# EAGLE design pov-globe2 (EAGLE 6.6.0)
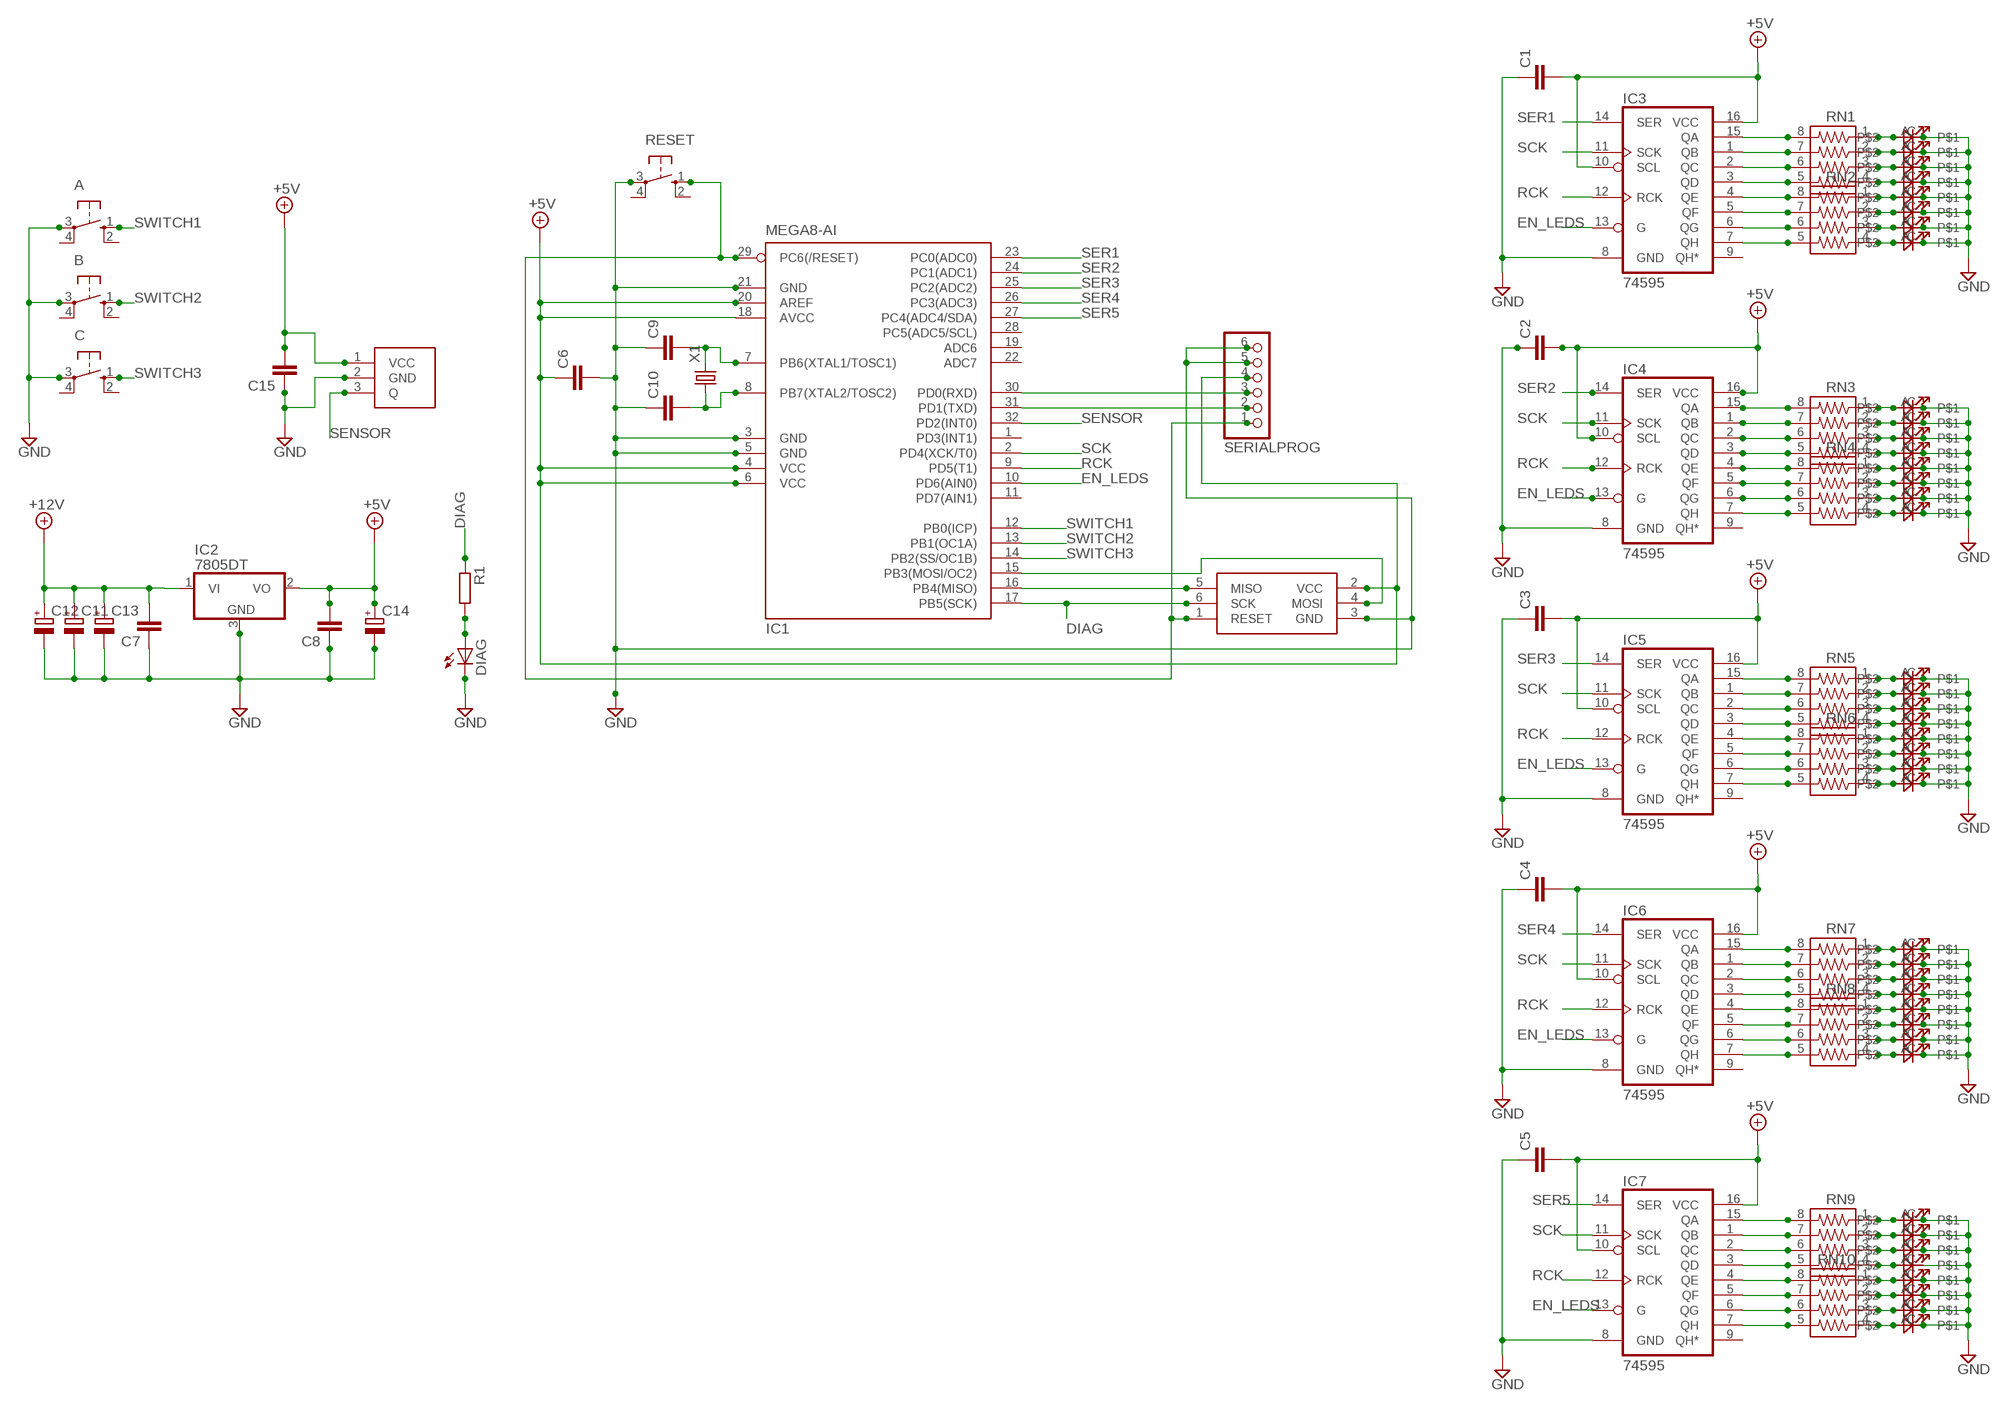
[diagram p0: schematic, sheet 1]

## Parts
0  3MMLEDSIDELED1_8MMSIDE  [LED1_8MMSIDE]
1  3MMLEDSIDELED1_8MMSIDE  [LED1_8MMSIDE]
2  3MMLEDSIDELED1_8MMSIDE  [LED1_8MMSIDE]
3  3MMLEDSIDELED1_8MMSIDE  [LED1_8MMSIDE]
4  3MMLEDSIDELED1_8MMSIDE  [LED1_8MMSIDE]
5  3MMLEDSIDELED1_8MMSIDE  [LED1_8MMSIDE]
6  3MMLEDSIDELED1_8MMSIDE  [LED1_8MMSIDE]
7  3MMLEDSIDELED1_8MMSIDE  [LED1_8MMSIDE]
8  3MMLEDSIDELED1_8MMSIDE  [LED1_8MMSIDE]
9  3MMLEDSIDELED1_8MMSIDE  [LED1_8MMSIDE]
10  3MMLEDSIDELED1_8MMSIDE  [LED1_8MMSIDE]
11  3MMLEDSIDELED1_8MMSIDE  [LED1_8MMSIDE]
12  3MMLEDSIDELED1_8MMSIDE  [LED1_8MMSIDE]
13  3MMLEDSIDELED1_8MMSIDE  [LED1_8MMSIDE]
14  3MMLEDSIDELED1_8MMSIDE  [LED1_8MMSIDE]
15  3MMLEDSIDELED1_8MMSIDE  [LED1_8MMSIDE]
16  3MMLEDSIDELED1_8MMSIDE  [LED1_8MMSIDE]
17  3MMLEDSIDELED1_8MMSIDE  [LED1_8MMSIDE]
18  3MMLEDSIDELED1_8MMSIDE  [LED1_8MMSIDE]
19  3MMLEDSIDELED1_8MMSIDE  [LED1_8MMSIDE]
20  3MMLEDSIDELED1_8MMSIDE  [LED1_8MMSIDE]
21  3MMLEDSIDELED1_8MMSIDE  [LED1_8MMSIDE]
22  3MMLEDSIDELED1_8MMSIDE  [LED1_8MMSIDE]
23  3MMLEDSIDELED1_8MMSIDE  [LED1_8MMSIDE]
24  3MMLEDSIDELED1_8MMSIDE  [LED1_8MMSIDE]
25  3MMLEDSIDELED1_8MMSIDE  [LED1_8MMSIDE]
26  3MMLEDSIDELED1_8MMSIDE  [LED1_8MMSIDE]
27  3MMLEDSIDELED1_8MMSIDE  [LED1_8MMSIDE]
28  3MMLEDSIDELED1_8MMSIDE  [LED1_8MMSIDE]
29  3MMLEDSIDELED1_8MMSIDE  [LED1_8MMSIDE]
30  3MMLEDSIDELED1_8MMSIDE  [LED1_8MMSIDE]
31  3MMLEDSIDELED1_8MMSIDE  [LED1_8MMSIDE]
32  3MMLEDSIDELED1_8MMSIDE  [LED1_8MMSIDE]
33  3MMLEDSIDELED1_8MMSIDE  [LED1_8MMSIDE]
34  3MMLEDSIDELED1_8MMSIDE  [LED1_8MMSIDE]
35  3MMLEDSIDELED1_8MMSIDE  [LED1_8MMSIDE]
36  3MMLEDSIDELED1_8MMSIDE  [LED1_8MMSIDE]
37  3MMLEDSIDELED1_8MMSIDE  [LED1_8MMSIDE]
38  3MMLEDSIDELED1_8MMSIDE  [LED1_8MMSIDE]
39  3MMLEDSIDELED1_8MMSIDE  [LED1_8MMSIDE]
A  10-XX  [B3F-10XX]
B  10-XX  [B3F-10XX]
C  10-XX  [B3F-10XX]
C1  C-EUC0805  [C0805]
C2  C-EUC0805  [C0805]
C3  C-EUC0805  [C0805]
C4  C-EUC0805  [C0805]
C5  C-EUC0805  [C0805]
C6  C-EUC0805  [C0805]
C7  C-EUC0805  [C0805]
C8  C-EUC0805  [C0805]
C9  C-EUC0805  [C0805]
C10  C-EUC0805  [C0805]
C11  CPOL-EUE2-5  [E2-5]
C12  CPOL-EUE2-5  [E2-5]
C13  CPOL-EUE2-5  [E2-5]
C14  CPOL-EUE2-5  [E2-5]
C15  C-EUC0805  [C0805]
DIAG  LEDCHIP-LED0805  [CHIP-LED0805]
IC1  MEGA8-AI  [TQFP32-08]
IC2  7805DT  [TO252]
IC3  74595  [TSSOP16]
IC4  74595  [TSSOP16]
IC5  74595  [TSSOP16]
IC6  74595  [TSSOP16]
IC7  74595  [TSSOP16]
ICSP  TAG_CONN_AVR  [TC2030-MCP-NL]
R1  R-EU_R0805  [R0805]
RESET  10-XX  [B3F-10XX]
RN1  741-8  [741-8]
RN2  741-8  [741-8]
RN3  741-8  [741-8]
RN4  741-8  [741-8]
RN5  741-8  [741-8]
RN6  741-8  [741-8]
RN7  741-8  [741-8]
RN8  741-8  [741-8]
RN9  741-8  [741-8]
RN10  741-8  [741-8]
S1  3144HALLSWITCH  [3144HALLSWITCH]
SERIALPROG  PINHD-1X6  [1X06]
X1  CRYSTALHC49U-V  [HC49U-V]

## Nets
+5V: C1.2 C2.2 C3.2 C4.2 C5.2 C6.1 C8.2 C14.+ C15.2 IC1.4(VCC) IC1.6(VCC) IC1.18(AVCC) IC1.20(AREF) IC2.2(VO) IC3.10(SCL) IC3.16(VCC) IC4.10(SCL) IC4.16(VCC) IC5.10(SCL) IC5.16(VCC) IC6.10(SCL) IC6.16(VCC) IC7.10(SCL) IC7.16(VCC) ICSP.2(VCC) S1.1(VCC) SERIALPROG.4
+12V: C7.2 C11.+ C12.+ C13.+ IC2.1(VI)
DIAG: IC1.17(PB5(SCK)) ICSP.6(SCK) R1.1
EN_LEDS: IC1.10(PD6(AIN0)) IC3.13(G) IC4.13(G) IC5.13(G) IC6.13(G) IC7.13(G)
GND: 0.C 1.C 2.C 3.C 4.C 5.C 6.C 7.C 8.C 9.C 10.C 11.C 12.C 13.C 14.C 15.C 16.C 17.C 18.C 19.C 20.C 21.C 22.C 23.C 24.C 25.C 26.C 27.C 28.C 29.C 30.C 31.C 32.C 33.C 34.C 35.C 36.C 37.C 38.C 39.C A.3(P) B.3(P) C1.1 C2.1 C3.1 C4.1 C5.1 C6.2 C7.1 C8.1 C9.1 C10.1 C11.- C12.- C13.- C14.- C15.1 C.3(P) DIAG.C IC1.3(GND) IC1.5(GND) IC1.21(GND) IC2.3(GND) IC3.8(GND) IC4.8(GND) IC5.8(GND) IC6.8(GND) IC7.8(GND) ICSP.3(GND) RESET.3(P) S1.2(GND) SERIALPROG.5 SERIALPROG.6
N$1: 0.A RN1.1
N$2: 1.A RN1.2
N$3: 2.A RN1.3
N$4: 3.A RN1.4
N$5: IC3.15(QA) RN1.8
N$6: IC3.1(QB) RN1.7
N$7: IC3.2(QC) RN1.6
N$8: IC3.3(QD) RN1.5
N$9: 4.A RN2.1
N$10: 5.A RN2.2
N$11: 6.A RN2.3
N$12: 7.A RN2.4
N$13: IC3.4(QE) RN2.8
N$14: IC3.5(QF) RN2.7
N$15: IC3.6(QG) RN2.6
N$16: IC3.7(QH) RN2.5
N$17: IC1.31(PD1(TXD)) SERIALPROG.2
N$18: IC1.30(PD0(RXD)) SERIALPROG.3
N$19: IC1.16(PB4(MISO)) ICSP.5(MISO)
N$20: IC6.15(QA) RN7.8
N$21: IC1.15(PB3(MOSI/OC2)) ICSP.4(MOSI)
N$22: IC6.1(QB) RN7.7
N$23: 8.A RN3.1
N$24: 9.A RN3.2
N$25: 10.A RN3.3
N$26: 11.A RN3.4
N$27: IC4.15(QA) RN3.8
N$28: IC4.1(QB) RN3.7
N$29: IC4.2(QC) RN3.6
N$30: IC4.3(QD) RN3.5
N$31: 12.A RN4.1
N$32: 13.A RN4.2
N$33: 14.A RN4.3
N$34: 15.A RN4.4
N$35: IC4.4(QE) RN4.8
N$36: IC4.5(QF) RN4.7
N$37: IC4.6(QG) RN4.6
N$38: IC1.29(PC6(/RESET)) ICSP.1(RESET) RESET.1(S) SERIALPROG.1
N$39: DIAG.A R1.2
N$40: IC4.7(QH) RN4.5
N$41: 16.A RN5.1
N$42: 17.A RN5.2
N$43: 18.A RN5.3
N$44: 19.A RN5.4
N$45: IC5.15(QA) RN5.8
N$46: IC5.1(QB) RN5.7
N$47: IC5.2(QC) RN5.6
N$48: IC5.3(QD) RN5.5
N$49: 20.A RN6.1
N$50: 21.A RN6.2
N$51: 22.A RN6.3
N$52: 23.A RN6.4
N$53: IC5.4(QE) RN6.8
N$54: IC5.5(QF) RN6.7
N$55: IC5.6(QG) RN6.6
N$56: IC5.7(QH) RN6.5
N$57: IC6.2(QC) RN7.6
N$58: IC6.3(QD) RN7.5
N$59: C9.2 IC1.7(PB6(XTAL1/TOSC1)) X1.2
N$60: C10.2 IC1.8(PB7(XTAL2/TOSC2)) X1.1
N$61: IC6.4(QE) RN8.8
N$62: IC6.5(QF) RN8.7
N$63: IC6.6(QG) RN8.6
N$64: IC6.7(QH) RN8.5
N$65: 39.A RN10.4
N$66: 31.A RN8.4
N$67: 30.A RN8.3
N$68: 29.A RN8.2
N$69: 28.A RN8.1
N$70: 27.A RN7.4
N$71: 26.A RN7.3
N$72: 25.A RN7.2
N$73: 24.A RN7.1
N$74: 38.A RN10.3
N$75: 37.A RN10.2
N$76: 36.A RN10.1
N$77: 35.A RN9.4
N$78: 34.A RN9.3
N$79: 33.A RN9.2
N$80: 32.A RN9.1
N$81: IC7.15(QA) RN9.8
N$82: IC7.1(QB) RN9.7
N$83: IC7.2(QC) RN9.6
N$84: IC7.3(QD) RN9.5
N$85: IC7.4(QE) RN10.8
N$86: IC7.5(QF) RN10.7
N$87: IC7.6(QG) RN10.6
N$88: IC7.7(QH) RN10.5
RCK: IC1.9(PD5(T1)) IC3.12(RCK) IC4.12(RCK) IC5.12(RCK) IC6.12(RCK) IC7.12(RCK)
SCK: IC1.2(PD4(XCK/T0)) IC3.11(SCK) IC4.11(SCK) IC5.11(SCK) IC6.11(SCK) IC7.11(SCK)
SENSOR: IC1.32(PD2(INT0)) S1.3(Q)
SER1: IC1.23(PC0(ADC0)) IC3.14(SER)
SER2: IC1.24(PC1(ADC1)) IC4.14(SER)
SER3: IC1.25(PC2(ADC2)) IC5.14(SER)
SER4: IC1.26(PC3(ADC3)) IC6.14(SER)
SER5: IC1.27(PC4(ADC4/SDA)) IC7.14(SER)
SWITCH1: A.1(S) IC1.12(PB0(ICP))
SWITCH2: B.1(S) IC1.13(PB1(OC1A))
SWITCH3: C.1(S) IC1.14(PB2(SS/OC1B))
Unconnected: A.2(S1) A.4(P1) B.2(S1) B.4(P1) C.2(S1) C.4(P1) IC1.1(PD3(INT1)) IC1.11(PD7(AIN1)) IC1.19(ADC6) IC1.22(ADC7) IC1.28(PC5(ADC5/SCL)) IC3.9(QH*) IC4.9(QH*) IC5.9(QH*) IC6.9(QH*) IC7.9(QH*) RESET.2(S1) RESET.4(P1)

## Library data of the parts
0 1-39 = jason_eagle6:3MMLEDSIDE
A B C RESET = switch-omron:10-XX: OMRON SWITCH
C1-C10 C15 = rcl:C-EU: CAPACITOR, European symbol
C11-C14 = rcl:CPOL-EU: POLARIZED CAPACITOR, European symbol
DIAG = led:LED: LED OSRAM: - CHIPLED LG R971, LG N971, LY N971, LG Q971, LY Q971, LO R971, LY R971 LH N974, LH R974 LS Q976, LO Q976, LY Q976 LO Q996 - Hyper CHIPLED LW Q18S LB Q993, LB Q99A, LB R99A - SideLED LS A670, LO A670, LY A670, LG A670, LP A670 LB A673, LV A673, LT A673, LW A673 LH A674 LY A675 LS A676, LA A676, LO A676, LY A676, LW A676 LS A679, LY A679, LG A679 - Hyper Micro SIDELED® LS Y876, LA Y876, LO Y876, LY Y876 LT Y87S - SmartLED LW L88C, LW L88S LB L89C, LB L89S, LG L890 LS L89K, LO L89K, LY L89K LS L896, LA L896, LO L896, LY L896 - TOPLED LS T670, LO T670, LY T670, LG T670, LP T670 LSG T670, LSP T670, LSY T670, LOP T670, LYG T670 LG T671, LOG T671, LSG T671 LB T673, LV T673, LT T673, LW T673 LH T674 LS T676, LA T676, LO T676, LY T676, LB T676, LH T676, LSB T676, LW T676 LB T67C, LV T67C, LT T67C, LS T67K, LO T67K, LY T67K, LW E67C LS E67B, LA E67B, LO E67B, LY E67B, LB E67C, LV E67C, LT E67C LW T67C LS T679, LY T679, LG T679 LS T770, LO T770, LY T770, LG T770, LP T770 LB T773, LV T773, LT T773, LW T773 LH T774 LS E675, LA E675, LY E675, LS T675 LS T776, LA T776, LO T776, LY T776, LB T776 LHGB T686 LT T68C, LB T68C - Hyper Mini TOPLED® LB M676 - Mini TOPLED Santana® LG M470 LS M47K, LO M47K, LY M47K Source: http://www.osram.convergy.de LUXEON: - LUMILED® LXK2-PW12-R00, LXK2-PW12-S00, LXK2-PW14-U00, LXK2-PW14-V00 LXK2-PM12-R00, LXK2-PM12-S00, LXK2-PM14-U00 LXK2-PE12-Q00, LXK2-PE12-R00, LXK2-PE12-S00, LXK2-PE14-T00, LXK2-PE14-U00 LXK2-PB12-K00, LXK2-PB12-L00, LXK2-PB12-M00, LXK2-PB14-N00, LXK2-PB14-P00, LXK2-PB14-Q00 LXK2-PR12-L00, LXK2-PR12-M00, LXK2-PR14-Q00, LXK2-PR14-R00 LXK2-PD12-Q00, LXK2-PD12-R00, LXK2-PD12-S00 LXK2-PH12-R00, LXK2-PH12-S00 LXK2-PL12-P00, LXK2-PL12-Q00, LXK2-PL12-R00 Source: www.luxeon.com KINGBRIGHT: KA-3528ASYC Source: www.kingbright.com
IC1 = atmel:MEGA8: MICROCONTROLLER 8 Kbytes FLASH, 1 kbytes SRAM, 512 bytes EEPROM, USART, 6-channel 10 bit ADC, 2-channel 8 bit ADC Pin compatible with Atmega48, ATMega88, ATMega168 Source: avr.lbr
IC2 = linear:78*: Positive VOLTAGE REGULATOR Source: http://cache.national.com/ds/LM/LM78L05.pdf http://www.fairchildsemi.com/ds/LM/LM7805.pdf
IC3-IC7 = SparkFun:74*595: 8-bit SHIFT REGISTER, output latch
ICSP = jasons_stuff:TAG_CONN_AVR
R1 = resistor:R-EU_: RESISTOR, European symbol
RN1-RN10 = resistor-array:741-8: CTS 741 Series 8 Terminations, 4 Resistors
S1 = jason_eagle6:3144HALLSWITCH
SERIALPROG = pinhead:PINHD-1X6: PIN HEADER
X1 = crystal:CRYSTAL: CRYSTAL

## Board
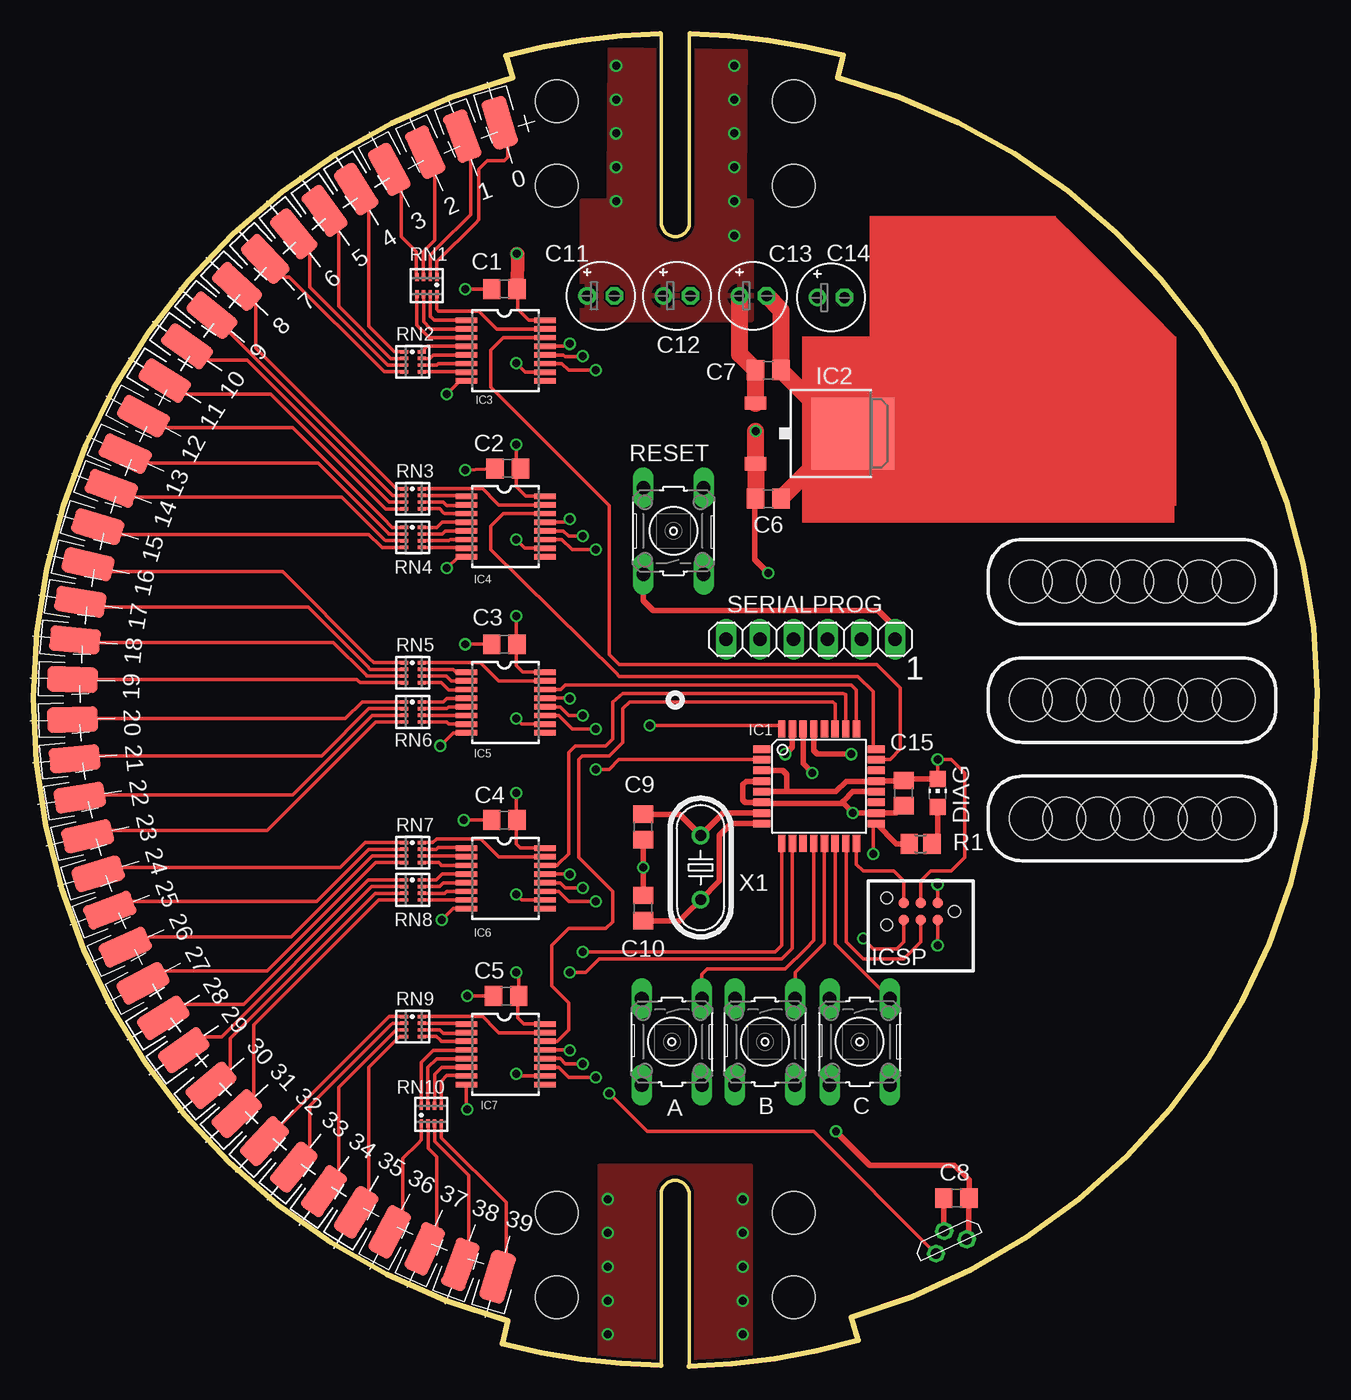
[diagram p1: board, top side]
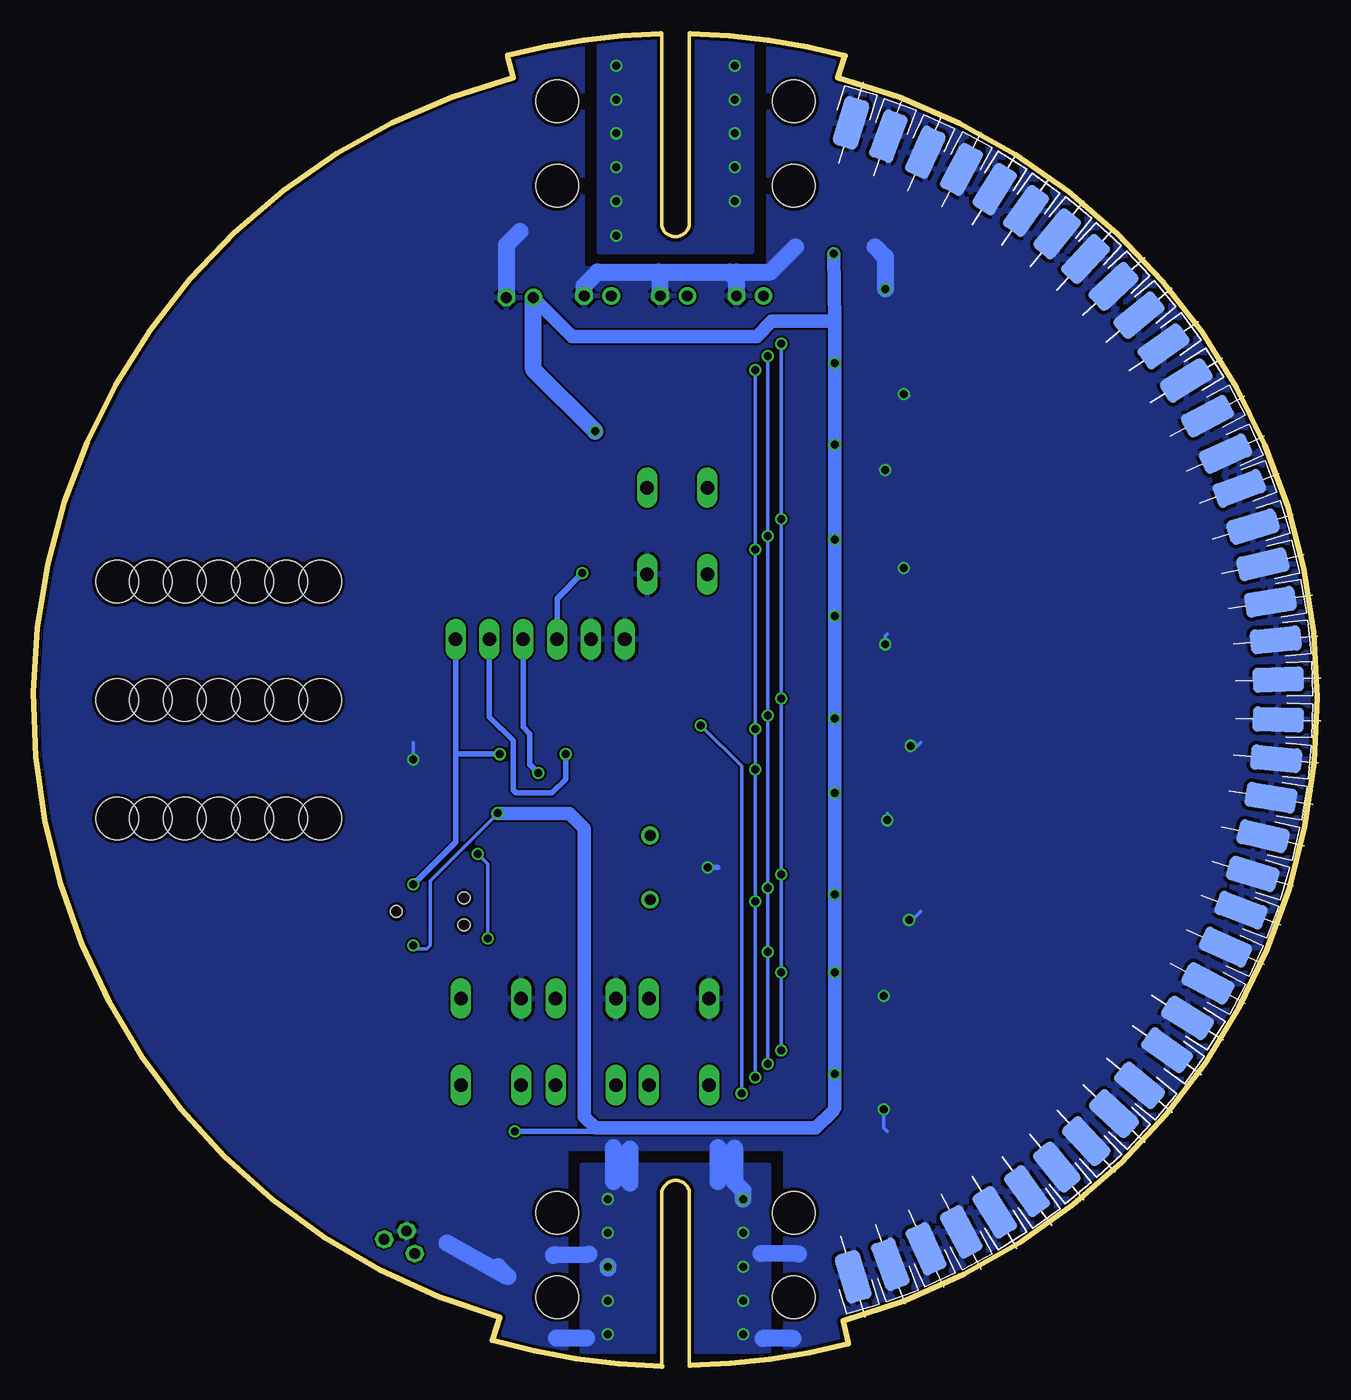
[diagram p2: board, bottom side, seen from below]

Size 96.38 x 100.08 mm. Coordinates in mm from the lower left corner, seen from the top.
Outline: 35.48,98.4 35.99,96.75 arc150 35.61,3.4 35.23,1.75
Outline: 61.9,2.01 61.39,3.66 arc149 60.37,96.75 60.75,98.27
Outline: 47.14,100.08 47.14,85.67
Outline: 49.22,100.03 49.22,85.65
Outline: 49.22,13.08 49.22,0 arc15 61.92,1.93
Outline: 47.14,0 47.14,13.11
Outline: 49.2,13.13 arc154 47.14,13.13
Outline: 47.16,85.62 arc154 49.22,85.62
Outline: 35.46,98.4 arc-13 47.06,100.05
Outline: 49.3,100.05 arc-13 60.78,98.42
Outline: 35.2,1.7 arc14 47.09,0.08
Copper layers (1*16): Top 0.035mm / dielectric 1.5mm / Bottom 0.035mm
Design rules "ITEADstudio_DRC": minimum track width 6mil, minimum drill 12mil, track to track 6mil, track to pad 6mil, pad to pad 6mil, via to via 6mil, smd to smd 0mil, copper to edge 10mil, drill to drill 10mil, minimum pad ring 10mil, minimum via ring 6mil, stop-mask expansion 2mil, vias tented up to drill 100mil, thermal gap 10mil
Holes 3.2 mm at 79.93,58.9 90.09,58.9 82.47,58.9 74.85,58.9 77.39,58.9 85.01,58.9 87.55,58.9 79.93,50.01 90.09,50.01 82.47,50.01 74.85,50.01 77.39,50.01 85.01,50.01 87.55,50.01 79.93,41.12 90.09,41.12 82.47,41.12 74.85,41.12 77.39,41.12 85.01,41.12 87.55,41.12 39.29,88.62 57.07,88.62 39.29,11.53 57.07,11.53 39.29,94.97 57.07,94.97 39.29,5.18 57.07,5.18

### Footprints (pad centres in the part's own frame; a part is rotated, then mirrored left to right if it is on the bottom)
LED1_8MMSIDE = smd 3.81 x 1.905: A -3.175,0 | smd 3.81 x 1.905 bottom: C -3.175,0
B3F-10XX = drill 1.016 long: 1 -3.251,2.261; 2 3.251,2.261; 3 -3.251,-2.261; 4 3.251,-2.261
C0805 = smd 1.3 x 1.5: 1 -0.95,0; 2 0.95,0
E2-5 = drill 0.813 pad 1.27: + -1.016,0 | drill 0.813 pad 1.27 octagon: - 1.016,0
CHIP-LED0805 = smd 1.2 x 1.2: A 0,-1.05; C 0,1.05
TQFP32-08 = smd 1.27 x 0.559: 1 -4.293,2.8; 2 -4.293,2; 3 -4.293,1.2; 4 -4.293,0.4; 5 -4.293,-0.4; 6 -4.293,-1.2; 7 -4.293,-2; 8 -4.293,-2.8; 17 4.293,-2.8; 18 4.293,-2; 19 4.293,-1.2; 20 4.293,-0.4; 21 4.293,0.4; 22 4.293,1.2; 23 4.293,2; 24 4.293,2.8 | smd 0.559 x 1.27: 9 -2.8,-4.293; 10 -2,-4.293; 11 -1.2,-4.293; 12 -0.4,-4.293; 13 0.4,-4.293; 14 1.2,-4.293; 15 2,-4.293; 16 2.8,-4.293; 25 2.8,4.293; 26 2,4.293; 27 1.2,4.293; 28 0.4,4.293; 29 -0.4,4.293; 30 -1.2,4.293; 31 -2,4.293; 32 -2.8,4.293
TO252 = smd 1 x 1.6: 1 -2.28,-4.8; 2 2.28,-4.8 | smd 5.4 x 6.2: 3 0,2.5
TSSOP16 = smd 0.4 x 1.6: 1 -2.225,-2.85; 2 -1.575,-2.85; 3 -0.925,-2.85; 4 -0.275,-2.85; 5 0.375,-2.85; 6 1.025,-2.85; 7 1.675,-2.85; 8 2.325,-2.85; 9 2.325,3.05; 10 1.675,3.05; 11 1.025,3.05; 12 0.375,3.05; 13 -0.275,3.05; 14 -0.925,3.05; 15 -1.575,3.05; 16 -2.225,3.05
TC2030-MCP-NL = smd 0.787 x 0.787: 1 1.27,-0.635; 2 1.27,0.635; 3 2.54,-0.635; 4 2.54,0.635; 5 3.81,-0.635; 6 3.81,0.635 | hole 0.889: 0,0; 5.08,-1.016; 5.08,1.016
R0805 = smd 1.3 x 1.5: 1 -0.85,0; 2 0.85,0
741-8 = smd 0.25 x 0.61: 1 -0.75,-0.65; 2 -0.25,-0.65; 3 0.25,-0.65; 4 0.75,-0.65; 5 0.75,0.65; 6 0.25,0.65; 7 -0.25,0.65; 8 -0.75,0.65
3144HALLSWITCH = drill 0.8 octagon: 1 -1.905,-1.27; 2 -0.635,0; 3 -1.905,1.27
1X06 = drill 1.016 long: 1 -6.35,0; 2 -3.81,0; 3 -1.27,0; 4 1.27,0; 5 3.81,0; 6 6.35,0
HC49U-V = drill 0.813: 1 -2.413,0; 2 2.413,0

### Placement (x,y rotation side)
0  34.08,96.39 106.9 top
1  31.09,95.33 110.6 top
2  28.11,94.03 114.4 top
3  25.22,92.66 118.1 top
4  22.55,91.08 121.9 top
5  20.01,89.33 125.6 top
6  17.52,87.48 129.4 top
7  15.24,85.45 133.1 top
8  12.98,83.24 136.9 top
9  10.94,80.92 140.6 top
10  8.96,78.44 144.4 top
11  7.16,75.69 148.1 top
12  5.46,72.82 151.9 top
13  4.01,69.82 155.6 top
14  2.89,67.03 159.4 top
15  1.8,63.96 163.1 top
16  1.01,60.93 166.9 top
17  0.4,57.91 170.6 top
18  -0.03,54.84 174.4 top
19  -0.23,51.66 178.1 top
20  -0.23,48.44 181.9 top
21  -0.05,45.29 185.6 top
22  0.35,42.16 189.4 top
23  0.99,39.07 193.1 top
24  1.83,36.04 196.9 top
25  2.76,33.12 200.6 top
26  4.01,30.15 204.4 top
27  5.43,27.25 208.1 top
28  7.06,24.49 211.9 top
29  8.71,21.87 215.6 top
30  10.89,19.08 219.4 top
31  12.95,16.79 223.1 top
32  15.19,14.58 226.9 top
33  17.55,12.5 230.6 top
34  19.96,10.57 234.4 top
35  22.55,8.86 238.1 top
36  25.24,7.29 241.9 top
37  28.06,5.92 245.6 top
38  30.93,4.67 249.4 top
39  33.93,3.68 253.1 top
A  47.93,24.36 270 top
B  54.91,24.36 270 top
C  62.02,24.36 270 top
C1  35.35,80.87 0 top
C2  35.61,67.41 0 top
C3  35.35,54.2 0 top
C4  35.35,41 0 top
C5  35.48,27.79 0 top
C6  55.17,65.13 0 top
C7  55.17,74.78 180 top
C8  69.29,12.62 0 top
C9  45.77,40.49 90 top
C10  45.77,34.39 270 top
C11  42.59,80.37 0 top
C12  48.31,80.37 0 top
C13  54.02,80.37 0 top
C14  59.86,80.24 0 top
C15  65.33,43.03 270 top
DIAG  67.87,43.03 0 top
IC1  58.98,43.54 0 top
IC2  59,70.03 270 top
IC3  35.35,76.3 270 top
IC4  35.35,63.09 270 top
IC5  35.35,49.89 270 top
IC6  35.35,36.68 270 top
IC7  35.35,23.47 270 top
ICSP  69.14,34.14 180 top
R1  66.6,39.22 0 top
RESET  48.05,62.71 90 top
RN1  29.54,81.13 180 top
RN2  28.5,75.41 270 top
RN3  28.5,65.13 270 top
RN4  28.5,62.23 270 top
RN5  28.5,52.07 270 top
RN6  28.5,49.12 270 top
RN7  28.5,38.56 270 top
RN8  28.5,35.76 270 top
RN9  28.5,25.5 270 top
RN10  29.87,18.9 0 top
S1  68.09,10.72 115 top
SERIALPROG  58.34,54.58 180 top
X1  50.09,37.44 90 top

### Tracks (layer width: path | path; a pad name or v marks a point on that pad's centre or on a via)
+5V  (via drill 0.6)
  Top 0.254: IC7.16 36.81,25.69 36.37,26.14 36.37,27.73 C5.2 36.43,29.38 v36.24,29.57 | 36.24,40.93 36.24,39.22 36.56,38.9 IC6.16 | 36.24,40.93 C4.2 | IC5.16 36.74,52.11 36.24,52.6 36.24,54.14 | 36.24,54.14 C3.2 | IC4.16 36.96,65.32 36.24,66.04 36.24,67.1 | 36.5,67.35 C2.2 36.24,67.1 | IC3.16 37.19,78.53 36.37,79.35 36.37,80.81 C1.2 | IC7.10 36.39,21.79 v36.24,21.95 | IC6.10 36.65,35 v36.24,35.41 | 36.24,40.93 v36.24,43.03 | IC5.10 36.67,48.21 v36.24,48.64 | 36.24,54.14 v36.24,56.34 | IC4.10 36.9,61.42 v36.24,62.08 | IC3.10 36.93,74.63 v36.24,75.31 | 36.24,67.1 v36.24,69.19 | 54.61,42.27 IC1.6 54.75,42.27 | ICSP.2 v67.87,31.6
  Top 0.406: C15.2 64.78,41.54 IC1.18 v61.52,41.54 60.82,42.23 60.82,42.46 | IC1.20 61.5,43.14 60.82,42.46 | 54.75,42.27 60.63,42.27 60.82,42.46 | IC1.6 53.44,42.34 53.26,42.52 53.26,43.66 53.51,43.92 54.66,43.92 IC1.4 | v60.25,17.63 62.79,15.09 69.14,15.09 70.24,13.99 C8.2 70.2,12.59 70.2,9.68 S1.1 | IC2.2 54.22,67.76 | C6.1 54.15,65.06 54.15,60.55 v55.17,59.54
  Top 1.016: C1.2 36.35,83.48 v36.29,83.54
  Top 1.27: IC2.2 54.22,67.73 C6.1 | 54.22,67.76 v54.22,70.21
  Bottom 0.254: 61.69,41.33 61.52,41.5 v61.52,41.54 61.69,41.36 61.69,41.33 | 61.69,41.33 66.6,36.42 66.6,31.6 66.85,31.34 67.61,31.34 v67.87,31.6
  Bottom 0.406: 55.04,18.72 53.95,17.63 | 53.95,17.63 53.9,17.63 | 53.95,17.63 v60.25,17.63 | 57.07,56.74 SERIALPROG.4 57.07,57.63 v55.17,59.54
  Bottom 1.016: v36.29,83.54 36.24,78.33 | 36.24,78.33 v36.24,75.31 v36.24,69.19 v36.24,62.08 v36.24,56.34 v36.24,48.64 v36.24,43.03 v36.24,35.41 v36.24,29.57 v36.24,21.95 36.24,19.41 36.37,19.15 37.64,17.88 54.15,17.88 55.04,18.72 55.04,40.39 56.16,41.5 61.52,41.5 | C14.+ 55.93,77.32 42.08,77.32 40.94,78.46 36.37,78.46 36.24,78.33
  Bottom 1.27: v54.22,70.21 58.85,74.84 C14.+
+12V  (via drill 0.6)
  Top 1.27: IC2.1 54.2,74.76 C7.2 53.01,75.99 C13.+
  other vias: 43.74,97.64 43.74,95.1 43.74,92.56 43.74,90.02 43.74,87.48 52.63,97.64 52.63,95.1 52.63,92.56 52.63,90.02 52.63,87.48 52.63,84.89
  pour Top: 43.23,98.91 43.1,83.54 53.39,83.41 53.51,98.78
  pour Bottom: 42.47,83.67 42.47,101.45 53.9,101.45 53.9,83.67
  pour Top: 47.55,78.59 53.9,78.59 53.9,87.48 41.2,87.48 41.2,78.59
DIAG  (via drill 0.6)
  Top 0.254: v63.04,38.46 63.04,40.51 IC1.17 | ICSP.6 65.33,31.85 64.82,31.34 63.04,31.34 v62.28,32.11
  Top 0.406: R1.1 64.79,39.22 IC1.17
  Bottom 0.254: v62.28,32.11 62.28,37.69 v63.04,38.46
EN_LEDS  (via drill 0.6)
  Top 0.254: IC5.13 39.98,50.16 v40.26,50.14 | IC6.13 40.23,36.95 v40.26,36.93 | IC7.13 40.02,23.74 v40.26,23.72 | IC4.13 40.02,63.37 v40.26,63.6 | IC3.13 40.07,76.58 v40.26,76.76 | IC1.10 56.98,31.38 56.18,30.58 42.47,30.58 41.45,29.57 v40.26,29.57
  Bottom 0.254: v40.26,76.76 40.26,64.62 | 40.26,64.62 v40.26,63.6 | v40.26,63.6 40.26,50.65 | 40.26,50.65 v40.26,50.14 | v40.26,50.14 40.26,37.95 | 40.26,37.95 v40.26,36.93 | v40.26,36.93 v40.26,29.57 | v40.26,29.57 40.26,27.79 | 40.26,27.79 40.26,25.25 | 40.26,25.25 v40.26,23.72 40.26,25.25 | v40.26,50.14 40.26,50.65 | v40.26,63.6 40.26,64.62 | v40.26,36.93 40.26,37.95 | v40.26,29.57 40.26,27.79
GND  (via drill 0.6)
  Top 0.254: C1.1 v32.43,80.87 | IC3.8 32.01,73.98 v31.04,73 | C2.1 v32.43,67.28 | IC4.8 31.89,60.77 v31.04,59.92 | C3.1 v32.43,54.2 | IC5.8 31.5,47.56 v30.53,46.58 | C4.1 v32.31,41 | IC6.8 31.5,34.35 v30.65,33.5 | C5.1 v32.56,27.79 | IC7.8 32.5,19.33 v32.56,19.28 | 63.16,44.04 IC1.21 | DIAG.C v67.87,45.57 68.88,45.57 69.9,44.55 69.9,38.2 68.88,37.19 67.36,37.19 66.6,36.42 ICSP.3 | S1.2 68.34,10.17
  Top 0.406: IC1.21 63.8,43.94 | 63.8,43.94 65.28,43.94 C15.1 65.43,44.08 DIAG.C | C10.1 v45.77,37.44 C9.1 | IC1.5 56.56,43.14 | 56.56,43.14 60.23,43.14 61.01,43.92 63.78,43.92 63.8,43.94 | IC1.3 56.25,44.74 56.56,44.42 56.56,43.14 | 68.34,10.17 C8.1
  Top 1.27: C13.- 56.12,79.29 C7.1 60.69,70.21 60.69,69.7 | C6.2 60.69,69.7 | 60.69,69.7 61.52,69.7 61.5,69.71 IC2.3
  Bottom 0.254: v31.04,73 30.78,73 30.65,72.87 | v32.43,67.28 32.81,67.41 32.56,67.16 | v31.04,59.92 31.04,59.54 | v32.43,54.2 32.43,54.84 32.31,54.97 | v30.53,46.58 30.02,46.58 29.77,46.84 | v32.31,41 32.31,41.5 | v30.65,33.5 30.4,33.5 29.77,34.14 | v32.56,27.79 32.31,27.79 | v32.56,19.28 32.56,17.88 32.31,17.63 | v67.87,45.57 67.87,46.84
  Bottom 0.406: v45.77,37.44 45.01,37.44 | 51.58,13.77 52.83,13.77 52.83,13.87
  Bottom 1.27: 59.86,85.19 60.88,84.18 C14.- | C13.- 55.04,81.13 54.02,82.14 49.45,82.14 | 49.45,82.14 44.12,82.14 43.61,81.64 | 43.61,81.64 C11.- | C12.- 49.32,82.02 49.45,82.14 | 43.61,81.64 43.61,82.14 41.07,82.14 39.16,84.05 | 33.19,84.05 32.43,83.29 v32.43,80.87 | 65.33,9.26 60.77,6.72 61.52,7.47 | v53.26,7.47 53.26,7.36 | 43.74,16.36 43.74,13.82 43.1,13.18 v43.1,12.55 | 51.58,13.77 51.58,16.31 | 57.32,8.31 57.32,8.33 | 45.01,16.41 45.01,13.87 | 52.83,13.87 52.83,16.41 | 38.96,8.43 41.75,8.46 | 39.37,2.08 41.63,2.08 | 54.86,2.11 57.12,2.11 | 57.22,8.38 54.66,8.41
  other vias: 43.1,2.39 43.1,4.93 43.1,7.47 43.1,10.01 53.26,2.39 53.26,4.93 53.26,10.01 53.26,12.55
  pour Top: 42.47,15.09 53.9,15.09 53.9,-1.42 42.47,-1.42
  pour Bottom: 41.2,100.18 41.2,82.4 55.17,82.4 55.17,100.18 100.89,100.18 100.89,-1.42 56.44,-1.42 56.44,16.36 39.93,16.36 39.93,-1.42 -7.06,-1.42 -7.06,100.18
  pour Bottom: 41.2,15.09 55.17,15.09 55.17,1.12 41.2,1.12
N$1
  Top 0.254: 0.A 35.01,92.27 35.61,91.67 35.61,90.78 35.35,90.53 34.08,90.53 33.45,89.89 33.45,86.46 33.45,86.08 33.19,85.83 30.29,82.92 RN1.1
N$2
  Top 0.254: 1.A 32.2,91.26 32.81,90.65 32.81,86.46 30.4,84.05 29.79,83.43 RN1.2
N$3
  Top 0.254: 2.A 29.43,90.23 30.15,89.51 30.15,84.56 29.26,83.67 29.26,81.81 RN1.3
N$4
  Top 0.254: 3.A 26.71,89.13 27.61,88.24 27.61,84.81 28.75,83.67 28.75,81.81 RN1.4
N$5
  Top 0.254: IC3.15 34.79,77.88 33.45,79.22 30.4,79.22 30.27,79.35 30.29,79.36 RN1.8
N$6
  Top 0.254: IC3.1 30.08,78.53 29.89,78.71 29.79,78.82 RN1.7
N$7
  Top 0.254: RN1.6 29.29,78.43 29.77,77.95 29.84,77.88 IC3.2
N$8
  Top 0.254: IC3.3 29.73,77.23 29,77.95 28.79,78.17 RN1.5
N$9
  Top 0.254: 4.A 24.23,87.81 25.19,86.84 25.19,78.08 27.1,76.17 27.83,76.17 RN2.1
N$10
  Top 0.254: 5.A 21.86,86.24 22.91,85.19 22.91,79.6 26.84,75.67 RN2.2
N$11
  Top 0.254: 6.A 19.54,84.75 20.75,83.54 20.75,81 26.59,75.16 RN2.3
N$12
  Top 0.254: 7.A 17.41,82.95 18.59,81.76 19.22,81.76 26.21,74.78 26.32,74.66 RN2.4
N$13
  Top 0.254: IC3.4 29.56,76.58 RN2.8
N$14
  Top 0.254: IC3.5 30.03,75.93 29.77,75.67 RN2.7
N$15
  Top 0.254: RN2.6 30.28,75.16 30.4,75.29 32.49,75.29 IC3.6
N$16
  Top 0.254: RN2.5 32.47,74.66 IC3.7
N$17  (via drill 0.6)
  Top 0.406: IC1.31 56.98,46.49 v56.44,45.95
  Bottom 0.406: SERIALPROG.2 62.15,48.74 60.37,46.96 60.37,43.28 60.12,43.03 57.45,43.03 56.44,44.04 v56.44,45.95
N$18  (via drill 0.6)
  Top 0.406: IC1.30 57.78,45.75 57.78,45.62 57.78,45.24 v58.47,44.55
  Bottom 0.406: SERIALPROG.3 59.61,53.57 59.61,47.98 59.1,47.47 59.1,45.19 v58.47,44.55
N$19
  Top 0.254: IC1.16 61.78,37.69 62.28,37.19 64.56,37.19 65.33,36.42 65.33,35.15 ICSP.5
N$20
  Top 0.254: RN7.8 29.98,39.31 30.27,39.6 33.58,39.6 34.85,38.33 34.92,38.25 IC6.15
N$21
  Top 0.254: IC1.15 61.01,39.21 61.01,32.11 61.01,31.85 61.26,31.6 62.28,30.58 65.33,30.58 65.58,30.84 66.09,31.34 66.6,31.85 ICSP.4
N$22
  Top 0.254: RN7.7 30.24,38.81 30.4,38.96 32.44,38.96 IC6.1
N$23
  Top 0.254: 8.A 15.35,81.07 16.68,79.73 16.68,76.43 27.23,65.89 27.83,65.89 RN3.1
N$24
  Top 0.254: 9.A 13.57,78.91 14.78,77.7 14.78,77.57 26.97,65.38 RN3.2
N$25
  Top 0.254: 10.A 11.95,76.59 13,75.54 16.05,75.54 26.72,64.87 RN3.3
N$26
  Top 0.254: 11.A 10.34,74.01 11.35,73 17.83,73 26.46,64.36 27.83,64.36 RN3.4
N$27
  Top 0.254: RN3.8 33.71,65.88 34.72,64.87 34.92,64.67 IC4.15
N$28
  Top 0.254: RN3.7 32.45,65.38 IC4.1
N$29
  Top 0.254: RN3.6 30.78,64.88 31.04,64.62 32.45,64.62 IC4.2
N$30
  Top 0.254: RN3.5 30.52,64.38 30.78,64.11 30.87,64.02 IC4.3
N$31
  Top 0.254: 12.A 8.96,71.33 9.83,70.46 19.48,70.46 26.21,63.73 26.96,62.98 RN4.1
N$32
  Top 0.254: 13.A 7.84,68.51 8.56,67.79 21.38,67.79 26.59,62.59 26.7,62.48 RN4.2
N$33
  Top 0.254: 14.A 6.88,65.91 7.54,65.25 23.16,65.25 26.34,62.08 26.43,61.98 RN4.3
N$34
  Top 0.254: 15.A 5.95,63.03 6.52,62.46 25.19,62.46 26.08,61.57 26.17,61.48 RN4.4
N$35
  Top 0.254: IC4.4 30.68,63.37 30.27,62.97 29.16,62.97 RN4.8
N$36
  Top 0.254: RN4.7 30.68,62.48 30.91,62.71 IC4.5
N$37
  Top 0.254: RN4.6 31.19,61.98 31.29,62.08 32.49,62.08 IC4.6
N$38  (via drill 0.6)
  Top 0.254: v67.87,36.17 ICSP.1
  Top 0.406: IC1.29 58.58,46.22 58.85,45.95 v61.39,45.95 | RESET.1 45.79,57.48 46.53,56.74 63.42,56.74 64.69,55.47 SERIALPROG.1
  Bottom 0.406: SERIALPROG.1 64.69,47.09 64.69,46.08 | 64.69,46.08 64.69,39.34 v67.87,36.17 | v61.39,45.95 64.56,45.95 64.69,46.08
N$39
  Top 0.406: DIAG.A 67.87,39.64 R1.2
N$40
  Top 0.254: RN4.5 32.44,61.48 IC4.7
N$41
  Top 0.254: 16.A 5.34,60.21 5.89,59.66 18.72,59.66 25.19,53.19 25.56,52.82 RN5.1
N$42
  Top 0.254: 17.A 4.99,57.39 5.38,57 20.62,57 25.07,52.55 25.3,52.32 RN5.2
N$43
  Top 0.254: 18.A 4.8,54.53 5,54.33 22.53,54.33 24.94,51.92 25.04,51.82 RN5.3
N$44
  Top 0.254: 19.A 23.39,51.56 24.28,51.56 | RN5.4 24.98,51.32 24.52,51.32 24.28,51.56 | 24.28,51.56 24.43,51.41
N$45
  Top 0.254: RN5.8 33.56,52.82 34.34,52.04 34.92,51.46 IC5.15
N$46
  Top 0.254: RN5.7 31.52,52.32 31.8,52.04 32.44,52.04 IC5.1
N$47
  Top 0.254: RN5.6 31.01,51.82 31.29,51.54 31.37,51.46 IC5.2
N$48
  Top 0.254: RN5.5 30.62,51.32 31.16,50.77 32.47,50.77 IC5.3
N$49
  Top 0.254: 20.A 4.67,48.54 4.75,48.62 23.42,48.62 24.69,49.89 27.83,49.89 RN6.1
N$50
  Top 0.254: 21.A 4.78,45.6 5,45.82 21.64,45.82 25.19,49.38 RN6.2
N$51
  Top 0.254: 22.A 5.04,42.68 5.25,42.9 19.48,42.9 25.45,48.87 RN6.3
N$52
  Top 0.254: 23.A 5.44,39.78 5.89,40.23 17.57,40.23 25.45,48.11 25.71,48.37 RN6.4
N$53
  Top 0.254: RN6.8 30.77,49.87 31.04,50.14 32.48,50.14 IC5.4
N$54
  Top 0.254: RN6.7 31.03,49.37 31.16,49.5 IC5.5
N$55
  Top 0.254: RN6.6 32.49,48.87 IC5.6
N$56
  Top 0.254: IC5.7 31.19,48.21 31.04,48.36 29.16,48.36 RN6.5
N$57
  Top 0.254: RN7.6 32.45,38.31 IC6.2
N$58
  Top 0.254: RN7.5 30.41,37.81 30.53,37.69 30.62,37.6 IC6.3
N$59
  Top 0.406: IC1.7 51.77,41.54 X1.2 49.52,40.42 48.5,41.44 C9.2
N$60
  Top 0.406: IC1.8 52.37,40.74 51.48,39.85 51.48,36.42 X1.1 49.01,33.95 48.5,33.44 C10.2
N$61
  Top 0.254: RN8.8 30.24,36.51 30.65,36.93 30.68,36.95 IC6.4
N$62
  Top 0.254: RN8.7 30.5,36.01 30.78,36.3 IC6.5
N$63
  Top 0.254: RN8.6 30.89,35.51 31.04,35.66 32.49,35.66 IC6.6
N$64
  Top 0.254: RN8.5 32.49,35.01 IC6.7
N$65
  Top 0.254: 39.A 34.85,7.86 35.48,8.48 35.48,12.29 30.65,17.12 30.62,17.16 RN10.4
N$66
  Top 0.254: 31.A 15.35,18.96 16.56,20.17 16.56,25.63 25.83,34.9 25.94,35.01 RN8.4
N$67
  Top 0.254: 30.A 13.67,21.09 14.78,22.2 14.78,24.61 25.57,35.41 25.68,35.51 RN8.3
N$68
  Top 0.254: 29.A 11.85,23.72 12.87,24.74 14.14,24.74 25.19,35.79 25.42,36.01 RN8.2
N$69
  Top 0.254: 28.A 10.36,26.16 11.35,27.15 15.8,27.15 25.07,36.42 25.16,36.51 RN8.1
N$70
  Top 0.254: 27.A 8.88,28.75 9.83,29.69 17.57,29.69 25.7,37.82 27.83,37.82 RN7.4
N$71
  Top 0.254: 26.A 7.91,31.46 8.68,32.23 19.35,32.23 25.45,38.33 27.82,38.33 RN7.3
N$72
  Top 0.254: 25.A 6.75,34.24 7.41,34.9 21.26,34.9 24.94,38.58 25.16,38.81 RN7.2
N$73
  Top 0.254: 24.A 6.18,36.97 6.65,37.44 23.03,37.44 24.69,39.09 24.9,39.31 RN7.1
N$74
  Top 0.254: 38.A 32.05,8.74 32.69,9.37 32.69,14.33 30.27,16.74 30.12,16.89 RN10.3
N$75
  Top 0.254: 37.A 29.38,9.49 30.27,10.39 30.27,15.72 29.64,16.36 29.64,18.23 RN10.2
N$76
  Top 0.254: 36.A 26.74,10.79 27.73,11.79 27.73,15.6 28.88,16.74 29.12,16.98 RN10.1
N$77
  Top 0.254: 35.A 24.23,12.09 25.19,13.06 25.19,22.45 26.72,23.98 27.49,24.75 RN9.4
N$78
  Top 0.254: 34.A 21.81,13.48 22.91,14.58 22.91,20.93 26.97,24.99 27.23,25.25 RN9.3
N$79
  Top 0.254: 33.A 19.56,15.05 20.75,16.23 20.75,19.53 26.84,25.63 26.97,25.75 RN9.2
N$80
  Top 0.254: 32.A 18.59,18.14 26.46,26.01 26.71,26.25 RN9.1
N$81
  Top 0.254: RN9.8 33.71,26.25 34.72,25.25 34.92,25.04 IC7.15
N$82
  Top 0.254: RN9.7 32.45,25.75 IC7.1
N$83
  Top 0.254: RN9.6 30.52,25.25 30.78,24.99 32.45,24.99 IC7.2
N$84
  Top 0.254: RN9.5 30.26,24.75 30.53,24.49 30.62,24.39 IC7.3
N$85
  Top 0.254: RN10.8 29.12,21.42 29.12,22.82 29.38,23.09 | IC7.4 32.48,23.72 31.42,23.72 30.02,23.72 29.38,23.09 | 29.38,23.09 29.26,22.96
N$86
  Top 0.254: RN10.7 29.62,21.16 29.62,22.43 30.27,23.09 31.54,23.09 IC7.5
N$87
  Top 0.254: RN10.6 30.12,21.03 30.12,21.92 30.65,22.45 31.54,22.45 32.49,22.45 IC7.6
N$88
  Top 0.254: RN10.5 30.62,20.77 30.62,21.4 31.04,21.82 31.67,21.82 32.48,21.82 IC7.7
RCK  (via drill 0.6)
  Top 0.254: IC5.12 39.54,49.51 40.18,48.87 v41.25,48.87 | IC4.12 39.79,62.72 40.18,62.33 v41.25,62.33 | IC6.12 39.54,36.3 39.93,35.92 v41.25,35.92 | IC7.12 39.54,23.09 39.93,22.71 v41.25,22.71 | IC3.12 39.79,75.93 39.93,75.79 41.2,75.79 v41.25,75.84 | IC1.9 56.18,31.59 55.67,31.09 v41.25,31.09
  Bottom 0.254: v41.25,75.84 41.25,64.62 | 41.25,64.62 41.25,63.35 | 41.25,63.35 v41.25,62.33 | v41.25,62.33 41.25,50.65 | 41.25,50.65 v41.25,48.87 | v41.25,48.87 41.25,36.68 | 41.25,36.68 v41.25,35.92 | v41.25,35.92 41.25,31.6 | 41.25,31.6 v41.25,31.09 | v41.25,31.09 41.25,25.25 | 41.25,25.25 v41.25,22.71 41.25,25.25 | 41.25,63.35 41.25,64.62 | v41.25,48.87 41.25,50.65 | v41.25,62.33 41.25,63.35 | v41.25,35.92 41.25,36.68 | v41.25,31.09 41.25,31.6
SCK  (via drill 0.6)
  Top 0.254: IC5.11 39.43,48.86 40.43,47.85 v42.21,47.85 | IC4.11 39.68,62.07 40.43,61.32 41.96,61.32 v42.21,61.32 | IC6.11 39.43,35.65 40.18,34.9 v42.21,34.9 | IC7.11 39.43,22.44 40.18,21.69 v42.21,21.69 | IC3.11 39.68,75.28 40.18,74.78 v42.21,74.78 | IC1.2 43.96,45.54 43.23,44.81 v42.21,44.81
  Bottom 0.254: v42.21,74.78 42.21,62.08 | 42.21,62.08 v42.21,61.32 | v42.21,61.32 42.21,50.65 | 42.21,50.65 v42.21,47.85 | v42.21,47.85 42.21,45.57 | 42.21,45.57 v42.21,44.81 | v42.21,44.81 42.21,43.03 | 42.21,43.03 42.21,39.22 | 42.21,39.22 v42.21,34.9 | v42.21,34.9 v42.21,21.69 42.21,22.45 | v42.21,47.85 42.21,50.65 | v42.21,61.32 42.21,62.08 | v42.21,34.9 42.21,39.22 | 42.21,45.57 v42.21,44.81 | v42.21,44.81 42.21,43.03 | v42.21,44.81 42.21,43.03
SENSOR  (via drill 0.6)
  Top 0.254: IC1.32 55.9,48.11 v46.28,48.11 | v43.23,20.47 46.07,17.63 56.44,17.63 57.71,17.63 58.58,17.63 S1.3
  Bottom 0.254: v46.28,48.11 43.23,45.06 43.23,43.03 43.23,21.51 v43.23,20.47
SER1
  Top 0.254: IC3.14 35.26,77.23 34.34,76.3 34.34,73.51 43.23,64.62 43.23,53.44 43.99,52.68 63.29,52.68 65.07,50.9 65.07,46.33 64.31,45.57 63.3,45.57 IC1.23
SER2
  Top 0.254: IC4.14 35.26,64.02 34.34,63.09 34.34,61.32 43.74,52.04 43.99,51.79 61.9,51.79 63.04,50.65 63.04,46.56 IC1.24
SER3
  Top 0.254: IC5.14 39.58,50.81 39.93,51.16 44.12,51.16 61.39,51.16 61.77,50.77 IC1.25
SER4
  Top 0.254: IC1.26 60.98,50.43 60.75,50.52 44.24,50.52 43.48,49.89 43.48,47.09 42.97,46.58 40.69,46.58 40.18,46.08 40.18,38.46 39.42,37.69 39.33,37.6 IC6.14
SER5
  Top 0.254: IC1.27 60.18,49.7 59.99,49.89 44.75,49.89 44.24,49.38 44.24,46.84 43.99,46.58 43.48,46.08 43.23,45.82 41.2,45.82 40.94,45.57 40.94,38.2 42.97,36.17 43.48,35.66 43.48,33.38 42.97,32.87 40.18,32.87 38.91,31.6 38.91,28.55 40.18,27.28 40.18,25.25 39.33,24.39 IC7.14
SWITCH1
  Top 0.254: IC1.12 58.58,31.96 57.96,31.34 56.44,29.82 50.59,29.82 50.19,29.41 A.1
SWITCH2
  Top 0.254: IC1.13 59.38,31.74 57.2,29.57 57.2,27.64 B.1
SWITCH3
  Top 0.254: IC1.14 60.18,31.72 C.1
(copper drawn outside any net)
  shapes: Top area x5

### Text on the board
tNames: 1
tDocu: hotchk155 | POV | POV | GLOBE | GLOBE | rev 2